# EAGLE design UAA180-VU-Meter-single (EAGLE 6.6.0)
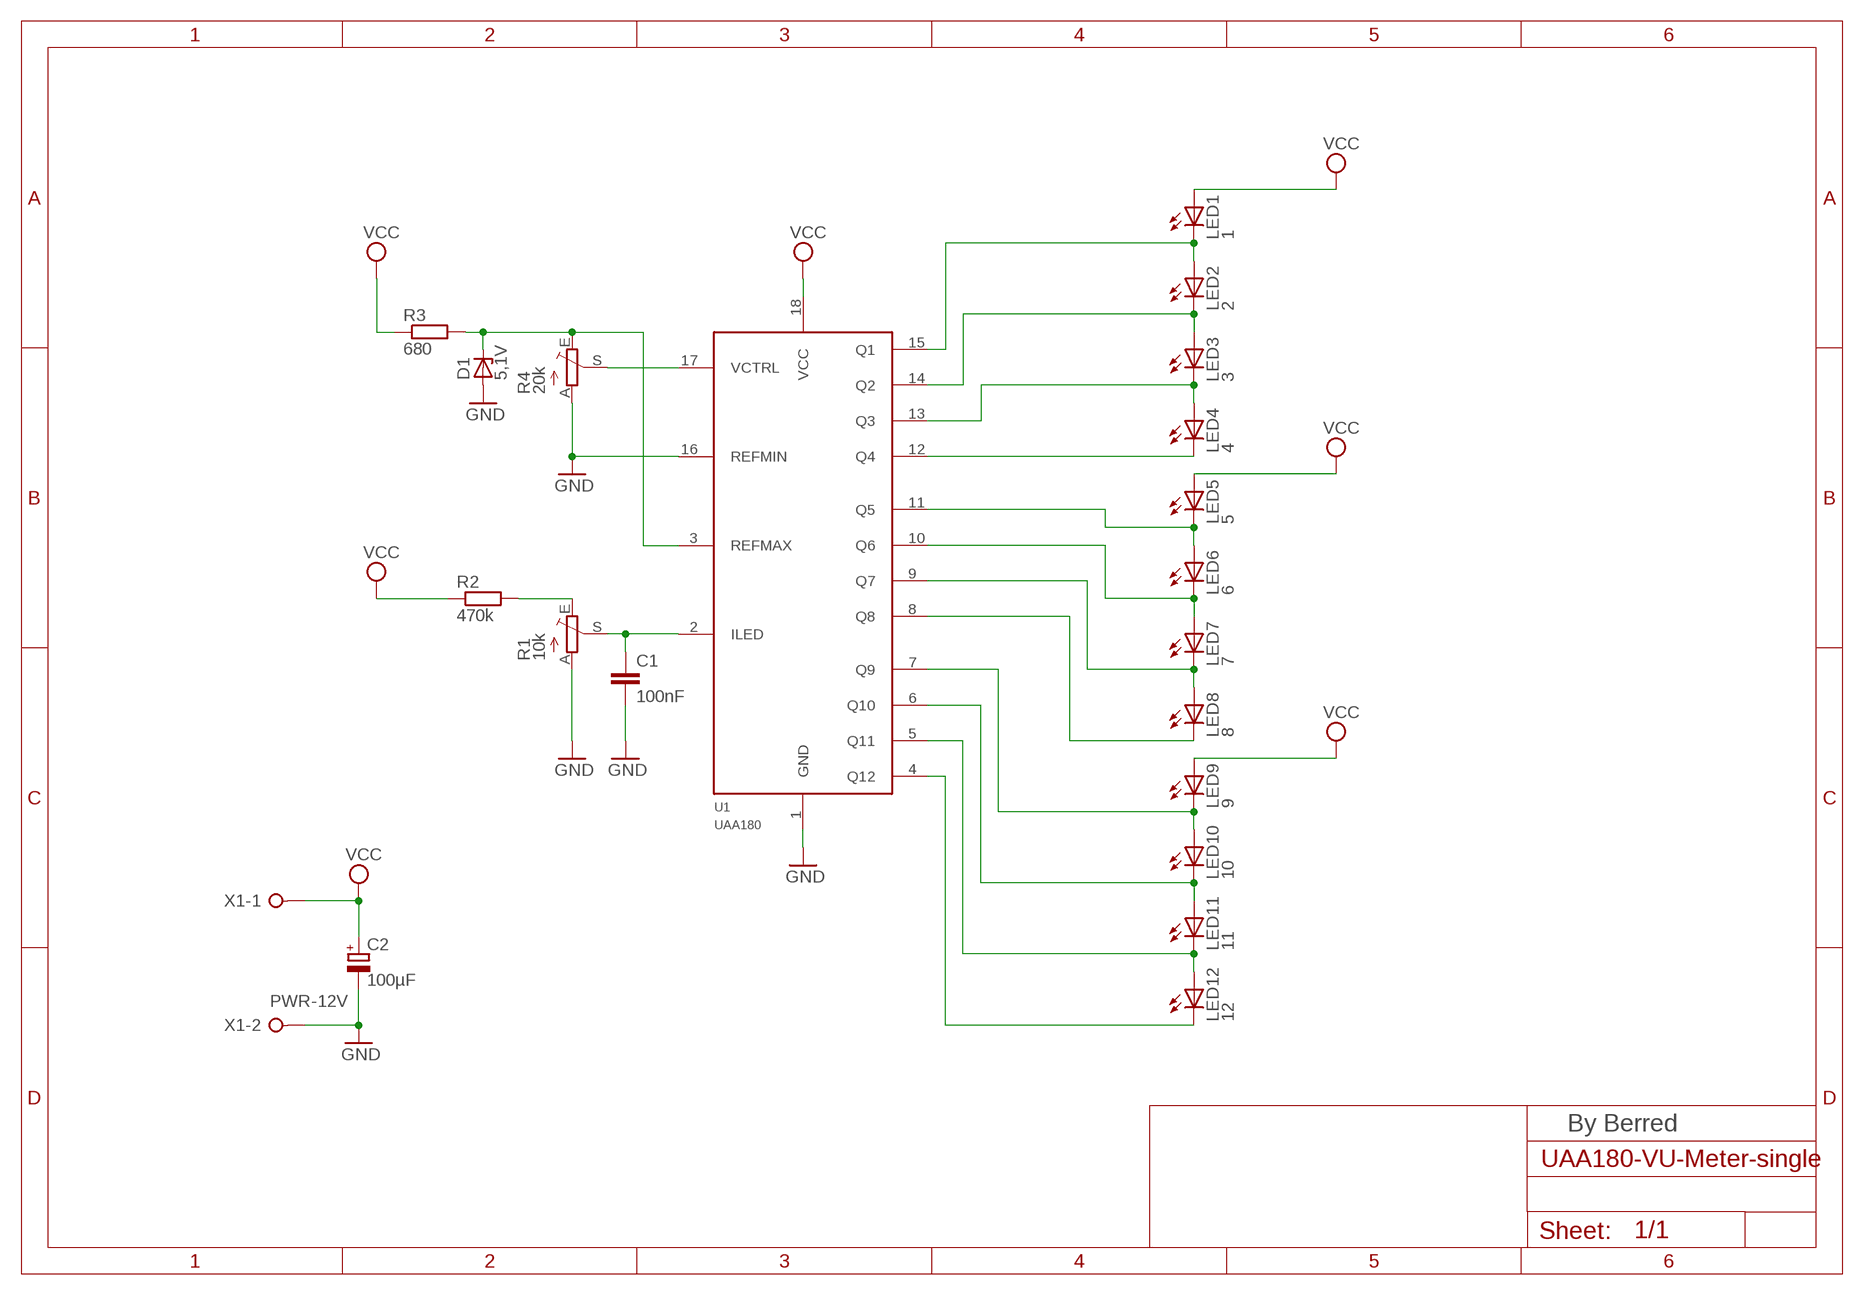
[diagram p0: schematic, sheet 1]

## Parts
C1  100nF  C-EU025-024X044  [C025-024X044]
C2  100µF  CPOL-EUE2.5-7  [E2,5-7]
D1  5,1V  ZPD  [DO35Z10]
LED1  1  LEDSQR2X5  [LED2X5]
LED2  2  LEDSQR2X5  [LED2X5]
LED3  3  LEDSQR2X5  [LED2X5]
LED4  4  LEDSQR2X5  [LED2X5]
LED5  5  LEDSQR2X5  [LED2X5]
LED6  6  LEDSQR2X5  [LED2X5]
LED7  7  LEDSQR2X5  [LED2X5]
LED8  8  LEDSQR2X5  [LED2X5]
LED9  9  LEDSQR2X5  [LED2X5]
LED10  10  LEDSQR2X5  [LED2X5]
LED11  11  LEDSQR2X5  [LED2X5]
LED12  12  LEDSQR2X5  [LED2X5]
R1  10k  TRIM_EU-B25P  [B25P]
R2  470k  R-EU_0207/10  [0207/10]
R3  680  R-EU_0207/10  [0207/10]
R4  20k  TRIM_EU-B25P  [B25P]
U1  UAA180  [DIL18]
X1  PWR-12V  W237-02P  [W237-132]

## Nets
GND: C1.2 C2.- D1.A R1.A R4.A U1.1(GND) U1.16(REFMIN) X1.2
N$1: LED1.K(C) LED2.A U1.15(Q1)
N$2: LED2.K(C) LED3.A U1.14(Q2)
N$3: LED3.K(C) LED4.A U1.13(Q3)
N$4: LED4.K(C) U1.12(Q4)
N$5: LED5.K(C) LED6.A U1.11(Q5)
N$6: LED6.K(C) LED7.A U1.10(Q6)
N$7: LED7.K(C) LED8.A U1.9(Q7)
N$8: R4.S U1.17(VCTRL)
N$9: C1.1 R1.S U1.2(ILED)
N$10: LED8.K(C) U1.8(Q8)
N$11: LED9.K(C) LED10.A U1.7(Q9)
N$12: LED10.K(C) LED11.A U1.6(Q10)
N$13: LED11.K(C) LED12.A U1.5(Q11)
N$14: LED12.K(C) U1.4(Q12)
N$15: R1.E R2.2
N$16: D1.C R3.2 R4.E U1.3(REFMAX)
VCC: C2.+ LED1.A LED5.A LED9.A R2.1 R3.1 U1.18(VCC) X1.1

## Notes on the sheet
- By Berred

## Library data of the parts
C1 = rcl:C-EU: CAPACITOR, European symbol
C2 = resistor:CPOL-EU: POLARIZED CAPACITOR, European symbol
D1 = diode:ZPD: Z DIODE 500 mW
LED1-LED12 = led:LED: LED OSRAM: - CHIPLED LG R971, LG N971, LY N971, LG Q971, LY Q971, LO R971, LY R971 LH N974, LH R974 LS Q976, LO Q976, LY Q976 LO Q996 - Hyper CHIPLED LW Q18S LB Q993, LB Q99A, LB R99A - SideLED LS A670, LO A670, LY A670, LG A670, LP A670 LB A673, LV A673, LT A673, LW A673 LH A674 LY A675 LS A676, LA A676, LO A676, LY A676, LW A676 LS A679, LY A679, LG A679 - Hyper Micro SIDELED® LS Y876, LA Y876, LO Y876, LY Y876 LT Y87S - SmartLED LW L88C, LW L88S LB L89C, LB L89S, LG L890 LS L89K, LO L89K, LY L89K LS L896, LA L896, LO L896, LY L896 - TOPLED LS T670, LO T670, LY T670, LG T670, LP T670 LSG T670, LSP T670, LSY T670, LOP T670, LYG T670 LG T671, LOG T671, LSG T671 LB T673, LV T673, LT T673, LW T673 LH T674 LS T676, LA T676, LO T676, LY T676, LB T676, LH T676, LSB T676, LW T676 LB T67C, LV T67C, LT T67C, LS T67K, LO T67K, LY T67K, LW E67C LS E67B, LA E67B, LO E67B, LY E67B, LB E67C, LV E67C, LT E67C LW T67C LS T679, LY T679, LG T679 LS T770, LO T770, LY T770, LG T770, LP T770 LB T773, LV T773, LT T773, LW T773 LH T774 LS E675, LA E675, LY E675, LS T675 LS T776, LA T776, LO T776, LY T776, LB T776 LHGB T686 LT T68C, LB T68C - Hyper Mini TOPLED® LB M676 - Mini TOPLED Santana® LG M470 LS M47K, LO M47K, LY M47K Source: http://www.osram.convergy.de LUXEON: - LUMILED® LXK2-PW12-R00, LXK2-PW12-S00, LXK2-PW14-U00, LXK2-PW14-V00 LXK2-PM12-R00, LXK2-PM12-S00, LXK2-PM14-U00 LXK2-PE12-Q00, LXK2-PE12-R00, LXK2-PE12-S00, LXK2-PE14-T00, LXK2-PE14-U00 LXK2-PB12-K00, LXK2-PB12-L00, LXK2-PB12-M00, LXK2-PB14-N00, LXK2-PB14-P00, LXK2-PB14-Q00 LXK2-PR12-L00, LXK2-PR12-M00, LXK2-PR14-Q00, LXK2-PR14-R00 LXK2-PD12-Q00, LXK2-PD12-R00, LXK2-PD12-S00 LXK2-PH12-R00, LXK2-PH12-S00 LXK2-PL12-P00, LXK2-PL12-Q00, LXK2-PL12-R00 Source: www.luxeon.com KINGBRIGHT: KA-3528ASYC Source: www.kingbright.com
R1 R4 = pot:TRIM_EU-: POTENTIOMETER
R2 R3 = rcl:R-EU_: RESISTOR, European symbol
U1 = siemens-vintage:UAA180
X1 = con-wago-508:W237-02P: WAGO SREW CLAMP; OC_FARNELL: unknown; OC_NEWARK: unknown

## Board
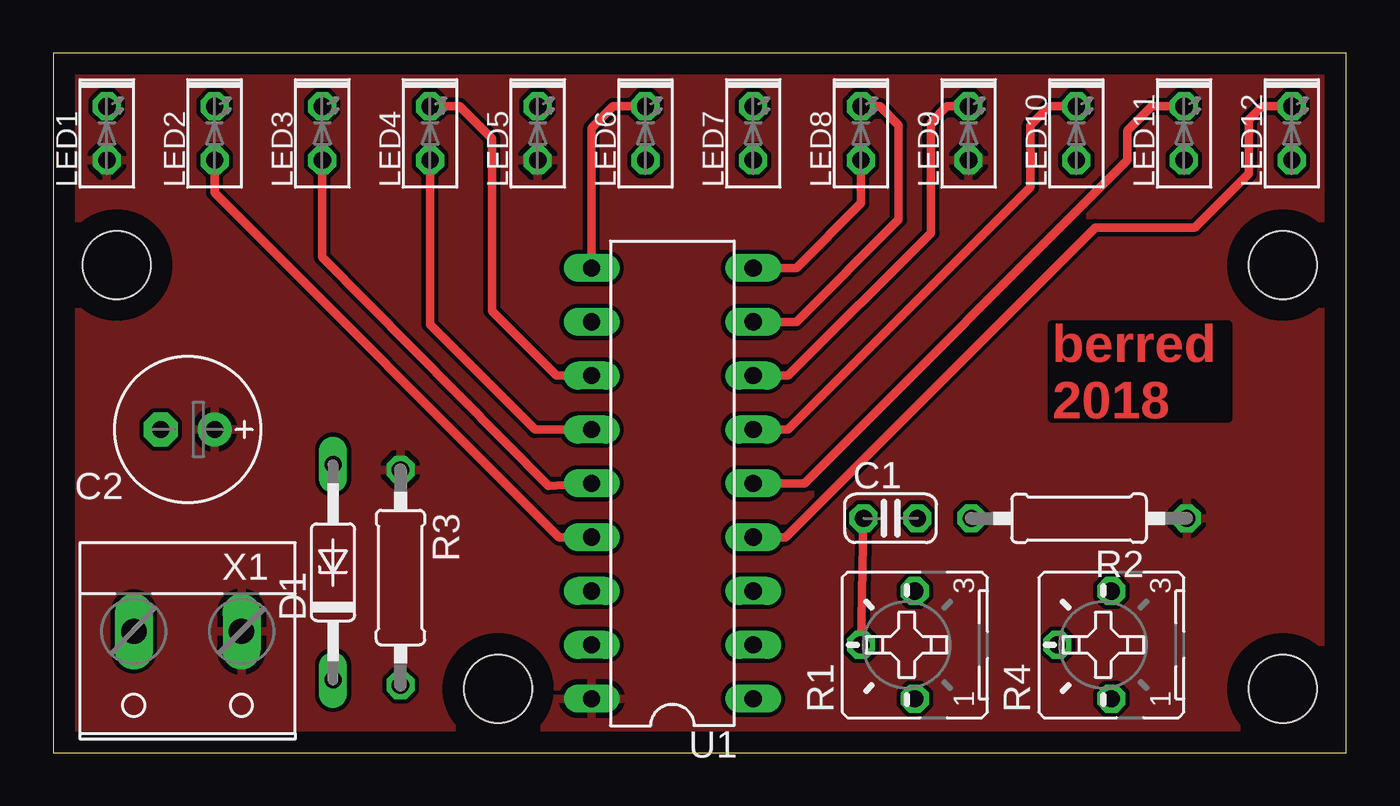
[diagram p1: board, top side]
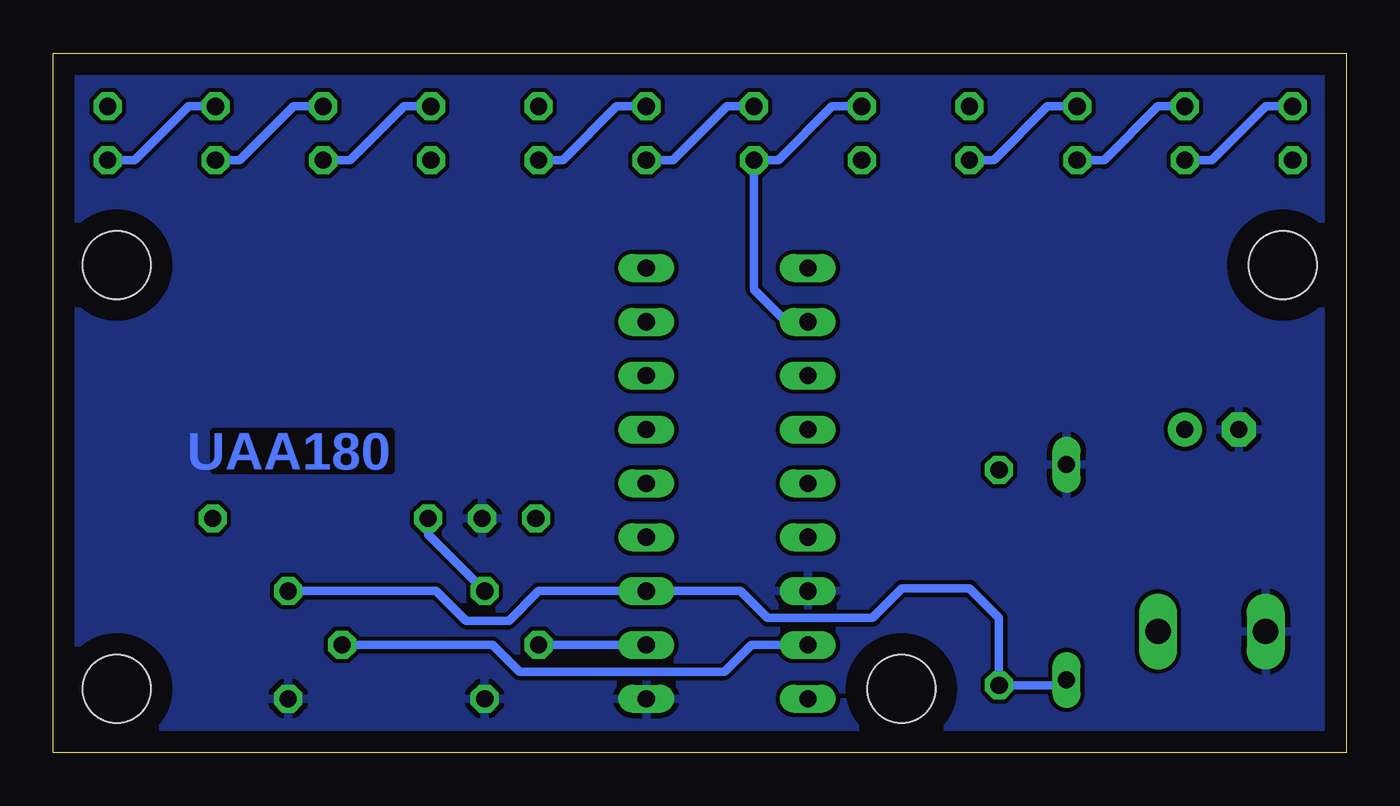
[diagram p2: board, bottom side, seen from below]

Size 61 x 33 mm. Coordinates in mm from the lower left corner, seen from the top.
Outline: 0,0 61,0 61,33 0,33 0,0
Copper layers (1*16): Top 0.035mm / dielectric 1.5mm / Bottom 0.035mm
Design rules "default": minimum track width 10mil, minimum drill 24mil, track to track 8mil, track to pad 8mil, pad to pad 8mil, via to via 8mil, smd to smd 8mil, copper to edge 40mil, drill to drill 8mil, minimum pad ring 10mil, minimum via ring 8mil, stop-mask expansion 4mil, vias tented up to drill 0mil, thermal gap 10mil
Holes 3.2 mm at 3,23 21,3 58,23 58,3

### Footprints (pad centres in the part's own frame; a part is rotated, then mirrored left to right if it is on the bottom)
C025-024X044 = drill 0.813 octagon: 1 -1.27,0; 2 1.27,0
E2,5-7 = drill 0.813 pad 1.6: + -1.27,0 | drill 0.813 pad 1.6 octagon: - 1.27,0
DO35Z10 = drill 0.813 long: A 5.08,0; C -5.08,0
LED2X5 = drill 0.813 octagon: A -1.27,0; K 1.27,0
B25P = drill 0.813 octagon: A -2.54,0; E 2.54,0; S 0,2.54
0207/10 = drill 0.813 octagon: 1 -5.08,0; 2 5.08,0
DIL18 = drill 0.813 long: 1 -10.16,-3.81; 2 -7.62,-3.81; 3 -5.08,-3.81; 4 -2.54,-3.81; 5 0,-3.81; 6 2.54,-3.81; 7 5.08,-3.81; 8 7.62,-3.81; 9 10.16,-3.81; 10 10.16,3.81; 11 7.62,3.81; 12 5.08,3.81; 13 2.54,3.81; 14 0,3.81; 15 -2.54,3.81; 16 -5.08,3.81; 17 -7.62,3.81; 18 -10.16,3.81
W237-132 = drill 1.194 long: 1 -2.54,-0.635; 2 2.54,-0.635

### Placement (x,y rotation side)
C1  39.5,11.05 0 top
C2  6.35,15.24 180 top
D1  13.21,8.51 90 top
LED1  2.54,29.21 90 top
LED2  7.62,29.21 90 top
LED3  12.7,29.21 90 top
LED4  17.78,29.21 90 top
LED5  22.86,29.21 90 top
LED6  27.94,29.21 90 top
LED7  33.02,29.21 90 top
LED8  38.1,29.21 90 top
LED9  43.18,29.21 90 top
LED10  48.26,29.21 90 top
LED11  53.34,29.21 90 top
LED12  58.42,29.21 90 top
R1  40.64,5.08 90 top
R2  48.39,11.05 180 top
R3  16.38,8.26 270 top
R4  49.91,5.08 90 top
U1  29.21,12.7 90 top
X1  6.35,5.08 180 top

### Tracks (layer width: path | path; a pad name or v marks a point on that pad's centre or on a via)
GND
  pour Bottom: 0,34 60.96,33.02 60.96,0 0,0
N$1
  Top 0.406: U1.15 23.88,10.16 7.62,26.42 LED2.A
  Bottom 0.406: LED1.K 3.81,30.48 6.35,27.94 LED2.A
N$2
  Top 0.406: U1.14 23.37,12.57 12.7,23.37 LED3.A
  Bottom 0.406: LED2.K 8.89,30.48 11.43,27.94 LED3.A
N$3
  Top 0.406: U1.13 22.73,15.24 17.78,20.19 LED4.A
  Bottom 0.406: LED3.K 14.1,30.48 16.64,27.94 LED4.A
N$4
  Top 0.406: U1.12 23.75,17.78 20.7,20.83 20.7,28.96 19.18,30.48 LED4.K
N$5
  Bottom 0.406: LED5.K 24.26,30.48 26.8,27.94 LED6.A 27.94,21.84 26.42,20.32 U1.11
N$6
  Top 0.406: U1.10 25.4,29.46 26.42,30.48 LED6.K
  Bottom 0.406: LED6.K 29.21,30.48 31.75,27.94 LED7.A
N$7
  Top 0.406: U1.9 35.05,22.86 38.1,25.91 LED8.A
  Bottom 0.406: LED7.K 34.42,30.48 36.96,27.94 LED8.A
N$8
  Bottom 0.406: R4.S 40.26,5.08 38.99,3.81 29.34,3.81 28.07,5.08 U1.17
N$9
  Top 0.406: C1.1 R1.S
  Bottom 0.406: U1.2 R1.S
N$10
  Top 0.406: U1.8 35.05,20.32 39.88,25.15 39.88,29.59 38.99,30.48 LED8.K
N$11
  Top 0.406: U1.7 34.67,17.78 41.4,24.51 41.4,29.72 42.16,30.48 LED9.K
  Bottom 0.406: LED9.K 44.45,30.48 46.99,27.94 LED10.A
N$12
  Top 0.406: U1.6 34.67,15.24 46.1,26.67 46.1,29.59 46.99,30.48 LED10.K
  Bottom 0.406: LED10.K 49.66,30.48 52.2,27.94 LED11.A
N$13
  Top 0.406: U1.5 35.43,12.7 50.67,27.94 50.67,29.34 51.82,30.48 LED11.K
  Bottom 0.406: LED11.K 54.61,30.48 57.15,27.94 LED12.A
N$14
  Top 0.406: U1.4 34.54,10.16 49.15,24.77 53.85,24.77 56.39,27.3 56.39,29.84 57.02,30.48 LED12.K
N$15
  Bottom 0.406: R2.2 43.31,10.29 R1.E
N$16
  Bottom 0.406: R4.E 42.93,7.62 41.53,6.22 39.5,6.22 38.1,7.62 U1.3 28.57,7.62 27.3,6.35 22.35,6.35 20.95,7.75 17.78,7.75 16.38,6.35 R3.2 13.46,3.17 D1.C
VCC
  pour Top: 0,33.02 60.96,33.02 60.96,0 0,0

### Text on the board
Top: berred / 2018
Bottom: UAA180